# EAGLE schematic SARA_U201 (EAGLE 9.3.0)
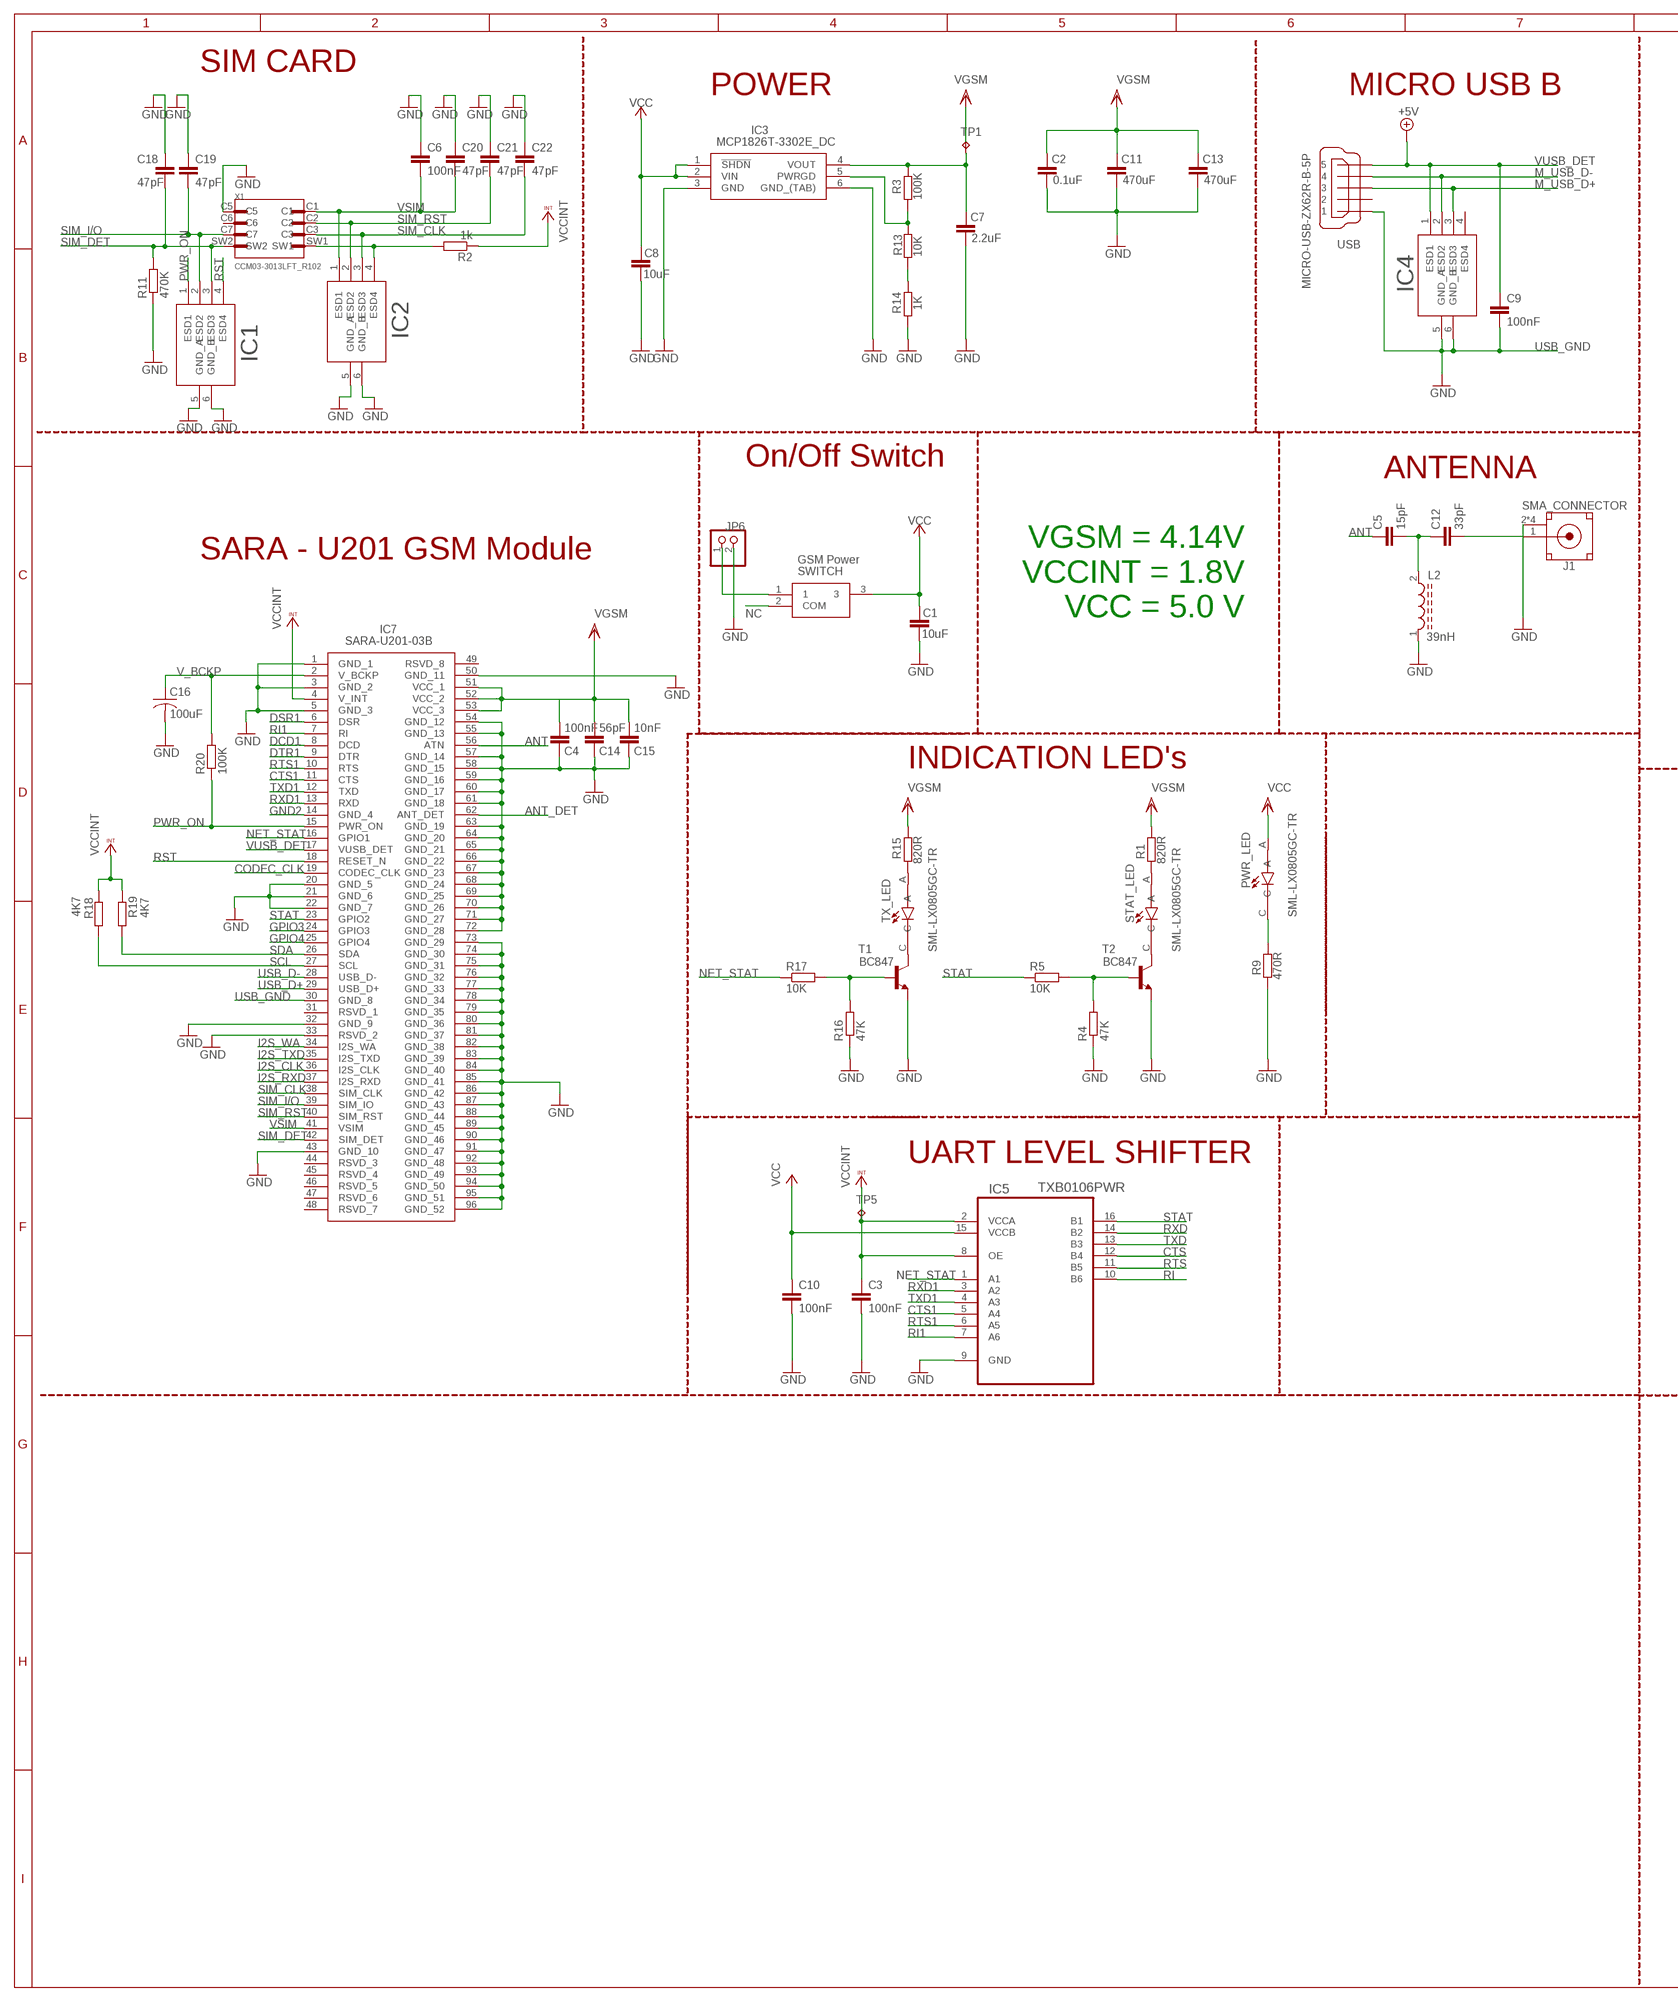
[diagram p0: schematic, sheet 1, part 1 of 2]
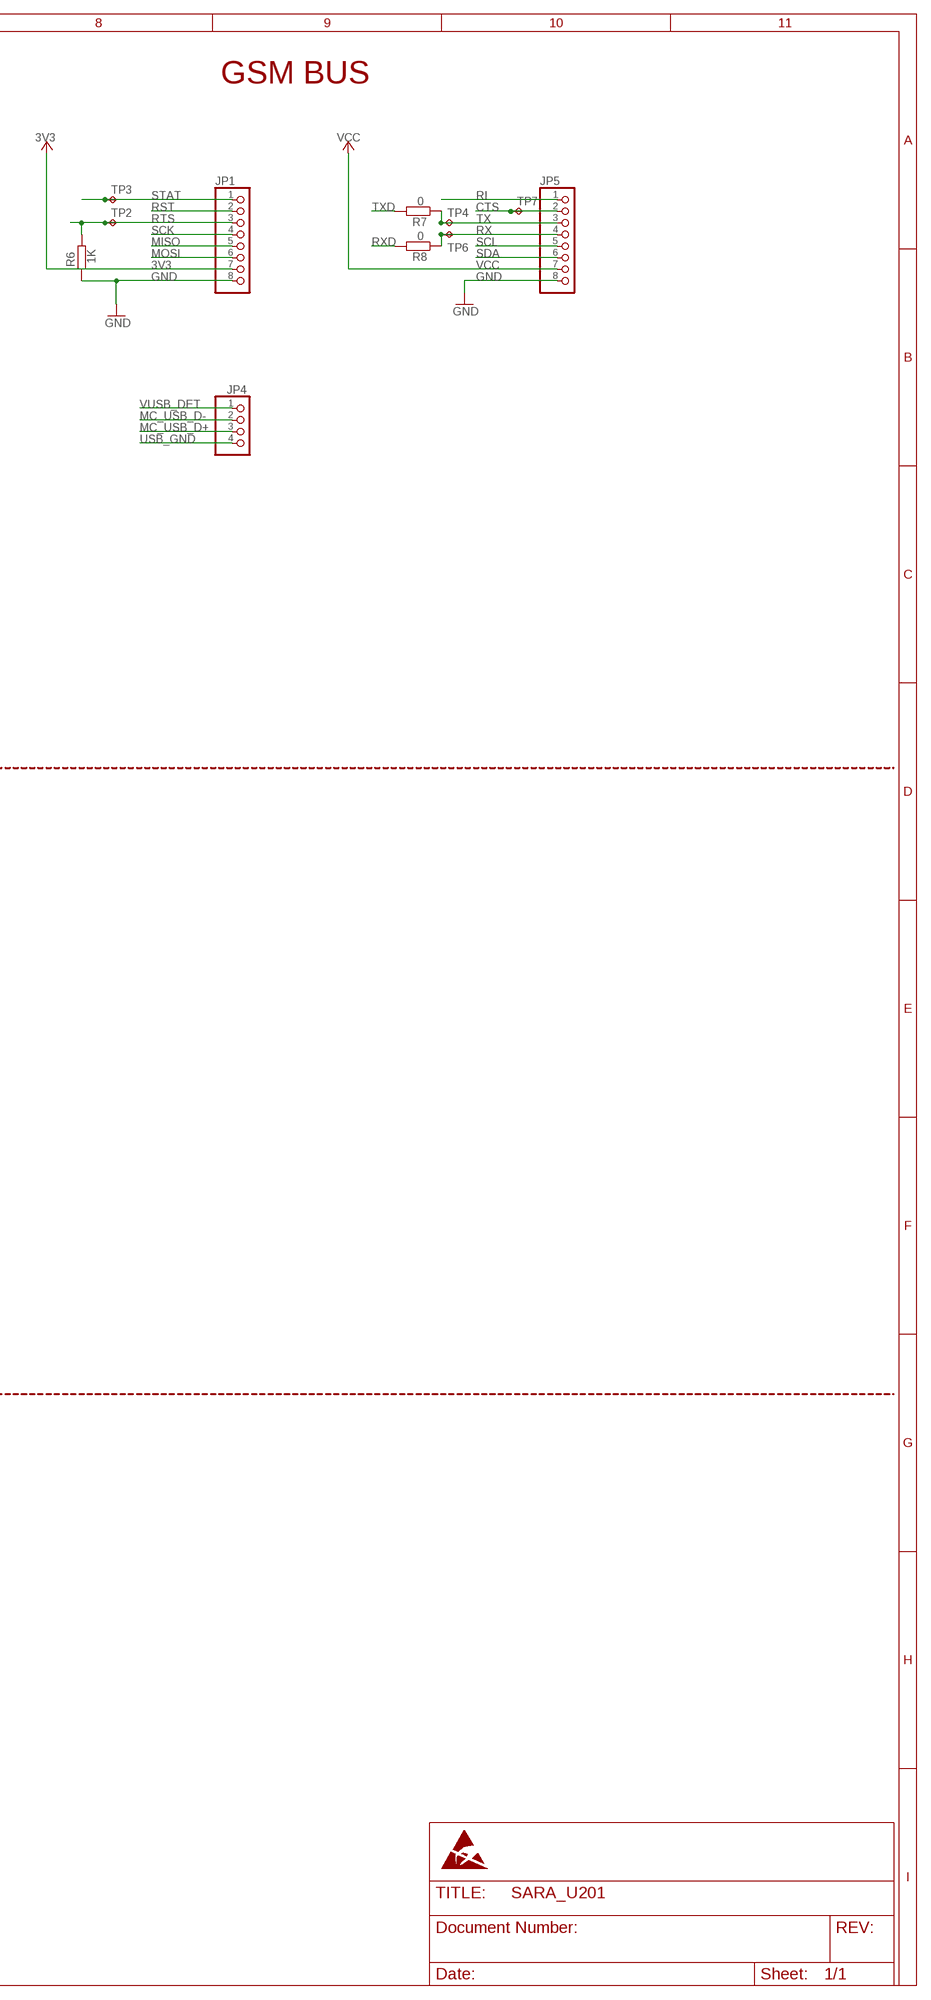
[diagram p1: schematic, sheet 1, part 2 of 2]

## Parts
C1  10uF  C-EUC0805  [C0805]
C2  0.1uF  C-EUC0805  [C0805]
C3  100nF  C-EUC0805  [C0805]
C4  100nF  C-EUC0805  [C0805]
C5  15pF  C-EUC0805  [C0805]
C6  100nF  C-EUC0805  [C0805]
C7  2.2uF  C-EUC0805  [C0805]
C8  10uF  C-EUC0805  [C0805]
C9  100nF  C-EUC0805  [C0805]
C10  100nF  C-EUC0805  [C0805]
C11  470uF  C-EUC0805  [C0805]
C12  33pF  C-EUC0805  [C0805]
C13  470uF  C-EUC0805  [C0805]
C14  56pF  C-EUC0805  [C0805]
C15  10nF  C-EUC0805  [C0805]
C16  100uF  C-USC0805  [C0805]
C18  47pF  C-EUC0805  [C0805]
C19  47pF  C-EUC0805  [C0805]
C20  47pF  C-EUC0805  [C0805]
C21  47pF  C-EUC0805  [C0805]
C22  47pF  C-EUC0805  [C0805]
IC1  SOT95P275X110-6N  [SOT95P275X110-6N]
IC2  SOT95P275X110-6N  [SOT95P275X110-6N]
IC3  MCP1826T-3302E_DC  [SOT127P706X180-6N]
IC4  SOT95P275X110-6N  [SOT95P275X110-6N]
IC5  TXB0106PWR  [SOP65P640X120-16N]
IC7  SARA-U201-03B  [SARA-U201-03B]
J1  SMA_CONNECTOR  [LPRS_SMA_CONNECTOR]
JP1  PINHD-1X8BIG  [1X08-BIG]
JP4  PINHD-1X4  [1X04]
JP5  PINHD-1X8BIG  [1X08-BIG]
JP6  PINHD-1X2  [1X02]
L2  39nH  SRR1260-470MLQW18AN39NJ8ZD  [FB_BLM18PG121SN1D]
PWR_LED  SML-LX0805GC-TR  [LEDC2012X120N]
R1  820R  R-EU_R0805  [R0805]
R2  1k  R-EU_R0805  [R0805]
R3  100K  R-EU_R0805  [R0805]
R4  47K  R-EU_R0805  [R0805]
R5  10K  R-EU_R0805  [R0805]
R6  1K  R-EU_R0805  [R0805]
R7  0  R-EU_R0805  [R0805]
R8  0  R-EU_R0805  [R0805]
R9  470R  R-EU_R0805  [R0805]
R11  470K  R-EU_R0805  [R0805]
R13  10K  R-EU_R0805  [R0805]
R14  1K  R-EU_R0805  [R0805]
R15  820R  R-EU_R0805  [R0805]
R16  47K  R-EU_R0805  [R0805]
R17  10K  R-EU_R0805  [R0805]
R18  4K7  R-EU_R0805  [R0805]
R19  4K7  R-EU_R0805  [R0805]
R20  100K  R-EU_R0805  [R0805]
STAT_LED  SML-LX0805GC-TR  [LEDC2012X120N]
SWITCH  GSM Power  EG1218  [3PIN_SLIDE_SWITCH]
T1  BC847  [SOT23]
T2  BC847  [SOT23]
TP1  TPB1,27  [B1,27]
TP2  TPB1,27  [B1,27]
TP3  TPB1,27  [B1,27]
TP4  TPB1,27  [B1,27]
TP5  TPB1,27  [B1,27]
TP6  TPB1,27  [B1,27]
TP7  TPB1,27  [B1,27]
TX_LED  SML-LX0805GC-TR  [LEDC2012X120N]
USB  MICRO-USB-ZX62R-B-5P  [ZX62R-B-5P]
X1  CCM03-3013LFT_R102  [C&K_CCM03-3013LFTR102]

## Nets
3V3: JP1.7 ; supply symbol labelled V+
ANT: C5.1 IC7.56(ATN)
ANT_DET: IC7.62(ANT_DET)
CODEC_CLK: IC7.19(CODEC_CLK)
CTS: IC5.12(B4) JP5.2 TP7.TP
CTS1: IC5.5(A4) IC7.11(CTS)
DCD1: IC7.8(DCD)
DSR1: IC7.6(DSR)
DTR1: IC7.9(DTR)
GND: C1.2 C2.2 C3.2 C4.1 C6.1 C7.2 C8.2 C10.2 C11.2 C13.2 C14.1 C15.1 C16.2 C18.1 C19.1 C20.1 C21.1 C22.1 IC1.5(GND_A) IC1.6(GND_B) IC2.5(GND_A) IC2.6(GND_B) IC3.3(GND) IC3.6(GND_(TAB)) IC5.9(GND) IC7.1(GND_1) IC7.3(GND_2) IC7.5(GND_3) IC7.20(GND_5) IC7.21(GND_6) IC7.22(GND_7) IC7.32(GND_9) IC7.33(RSVD_2) IC7.43(GND_10) IC7.50(GND_11) IC7.54(GND_12) IC7.55(GND_13) IC7.57(GND_14) IC7.58(GND_15) IC7.59(GND_16) IC7.60(GND_17) IC7.61(GND_18) IC7.63(GND_19) IC7.64(GND_20) IC7.65(GND_21) IC7.66(GND_22) IC7.67(GND_23) IC7.68(GND_24) IC7.69(GND_25) IC7.70(GND_26) IC7.71(GND_27) IC7.72(GND_28) IC7.73(GND_29) IC7.74(GND_30) IC7.75(GND_31) IC7.76(GND_32) IC7.77(GND_33) IC7.78(GND_34) IC7.79(GND_35) IC7.80(GND_36) IC7.81(GND_37) IC7.82(GND_38) IC7.83(GND_39) IC7.84(GND_40) IC7.85(GND_41) IC7.86(GND_42) IC7.87(GND_43) IC7.88(GND_44) IC7.89(GND_45) IC7.90(GND_46) IC7.91(GND_47) IC7.92(GND_48) IC7.93(GND_49) IC7.94(GND_50) IC7.95(GND_51) IC7.96(GND_52) J1.2(GND) J1.3(GND) J1.4(GND) J1.5(GND) JP1.8 JP5.8 JP6.2 L2.1 R4.1 R6.1 R9.1 R11.1 R14.1 R16.1 T1.2(E) T2.2(E) X1.C5
GND2: IC7.14(GND_4)
GPIO3: IC7.24(GPIO3)
GPIO4: IC7.25(GPIO4)
I2S_CLK: IC7.36(I2S_CLK)
I2S_RXD: IC7.37(I2S_RXD)
I2S_TXD: IC7.35(I2S_TXD)
I2S_WA: IC7.34(I2S_WA)
M_USB_D+: IC4.3(ESD3) USB.3
M_USB_D-: IC4.2(ESD2) USB.4
MC_USB_D+: JP4.3
MC_USB_D-: JP4.2
MISO: JP1.5
MOSI: JP1.6
N$1: STAT_LED.C T2.3(C)
N$2: IC3.5(PWRGD) R3.1 R13.2
N$3: R13.1 R14.2
N$4: JP6.1 SWITCH.1
N$5: IC2.4(ESD4) R2.2 X1.SW1
N$6: C12.2 J1.1(SIG)
N$7: C5.2 C12.1 L2.2
N$8: T1.3(C) TX_LED.C
N$9: R15.1 TX_LED.A
N$10: R1.1 STAT_LED.A
N$11: PWR_LED.C R9.2
NC: SWITCH.2(COM)
NET_STAT: IC5.1(A1) IC7.16(GPIO1) R4.2 R5.2 R16.2 R17.1 R17.2 T1.1(B) T2.1(B)
PWR_ON: IC1.1(ESD1) IC7.15(PWR_ON) R20.1
RI: IC5.10(B6) JP5.1
RI1: IC5.7(A6) IC7.7(RI)
RST: IC1.4(ESD4) IC7.18(RESET_N) JP1.2
RTS: IC5.11(B5) JP1.3 R6.2 TP2.TP
RTS1: IC5.6(A5) IC7.10(RTS)
RX: JP5.4 R8.1 TP6.TP
RXD: IC5.14(B2) R8.2
RXD1: IC5.3(A2) IC7.13(RXD)
SCK: JP1.4
SCL: IC7.27(SCL) JP5.5 R18.2
SDA: IC7.26(SDA) JP5.6 R19.2
SIM_CLK: C22.2 IC2.3(ESD3) IC7.38(SIM_CLK) X1.C3
SIM_DET: C18.2 IC1.3(ESD3) IC7.42(SIM_DET) R11.2 X1.SW2
SIM_I/O: C19.2 IC1.2(ESD2) IC7.39(SIM_IO) X1.C7
SIM_RST: C21.2 IC2.2(ESD2) IC7.40(SIM_RST) X1.C2
STAT: IC5.16(B1) IC7.23(GPIO2) JP1.1 R5.1 TP3.TP
TX: JP5.3 R7.1 TP4.TP
TXD: IC5.13(B3) R7.2
TXD1: IC5.4(A3) IC7.12(TXD)
USB_D+: IC7.29(USB_D+)
USB_D-: IC7.28(USB_D-)
USB_GND: C9.2 IC4.5(GND_A) IC4.6(GND_B) IC7.30(GND_8) JP4.4 USB.1 ; supply symbol labelled GND
V_BCKP: C16.1 IC7.2(V_BCKP) R20.2
VCC: C1.1 C8.1 C10.1 IC3.1(!SHDN) IC3.2(VIN) IC5.15(VCCB) JP5.7 PWR_LED.A SWITCH.3 ; supply symbol labelled V+, VDD
VCCINT: C3.1 IC5.2(VCCA) IC5.8(OE) IC7.4(V_INT) R2.1 R18.1 R19.1 TP5.TP
VDD: C2.1 C11.1 C13.1
VGSM: C4.2 C7.1 C14.2 C15.2 IC3.4(VOUT) IC7.51(VCC_1) IC7.52(VCC_2) IC7.53(VCC_3) R1.2 R3.2 R15.2 TP1.TP ; supply symbol labelled VDD
VSIM: C6.2 C20.2 IC2.1(ESD1) IC7.41(VSIM) X1.C1
VUSB_DET: C9.1 IC4.1(ESD1) IC7.17(VUSB_DET) JP4.1 USB.5 ; supply symbol labelled +5V
Unconnected: IC4.4(ESD4) IC7.31(RSVD_1) IC7.44(RSVD_3) IC7.45(RSVD_4) IC7.46(RSVD_5) IC7.47(RSVD_6) IC7.48(RSVD_7) IC7.49(RSVD_8) USB.2 X1.C6

## Notes on the sheet
- SIM CARD
- GSM BUS
- POWER | MICRO USB B
- IC4
- IC2
- IC1
- On/Off Switch
- ANTENNA
- VGSM = 4.14V
  VCCINT = 1.8V
  VCC = 5.0 V
- SARA - U201 GSM Module
- INDICATION LED's
- UART LEVEL SHIFTER

## Library data of the parts
C1-C15 C18-C22 = rcl:C-EU: CAPACITOR, European symbol; SPICEPREFIX: C
C16 = rcl:C-US: CAPACITOR, American symbol; SPICEPREFIX: C
IC1 IC2 IC4 = SOT95P275X110-6N:SOT95P275X110-6N
IC3 = MCP1826T-3302E_DC:MCP1826T-3302E_DC: LDO Regulator 1A 3.3V PG SOT223-5 MCP1826T-3302E/DC, Low Dropout Voltage Regulator, 1A, 3.3 V +/-2%, 2.3 6 Vin, 6-Pin SOT-223 Source: Datasheet <http://ww1.microchip.com/downloads/en/DeviceDoc/22057B.pdf>; ALLIED_NUMBER: 70048318; ALLIED_PRICE-STOCK: http://www.alliedelec.com/microchip-technology-inc-mcp1826t-3302e-dc/70048318/; DESCRIPTION: LDO Regulator 1A 3.3V PG SOT223-5 MCP1826T-3302E/DC, Low Dropout Voltage Regulator, 1A, 3.3 V +/-2%, 2.3 6 Vin, 6-Pin SOT-223; HEIGHT: 1.8mm; MANUFACTURER_NAME: Microchip; MANUFACTURER_PART_NUMBER: MCP1826T-3302E/DC; MOUSER_PART_NUMBER: 579-MCP1826T-3302EDC; MOUSER_PRICE-STOCK: https://www.mouser.com/Search/Refine.aspx?Keyword=579-MCP1826T-3302EDC; RS_PART_NUMBER: 6695190P; RS_PRICE-STOCK: http://uk.rs-online.com/web/p/products/6695190P
IC5 = TXB0106PWR:TXB0106PWR: VOLTAGE-LEVEL TRANSLATOR; DESCRIPTION: 6-Bit Bidirectional Voltage-Level Translator with Auto Direction Sensing and +/-15-kV ESD Protect 16-TSSOP -40 to 85; DIGI-KEY_PART_NUMBER: 296-23759-1-ND; DIGI-KEY_PURCHASE_URL: https://www.digikey.in/product-detail/en/texas-instruments/TXB0106PWR/296-23759-1-ND/1951146?utm_source=snapeda&utm_medium=aggregator&utm_campaign=symbol; MF: Texas Instruments; MP: TXB0106PWR; PACKAGE: TSSOP-16 Texas Instruments
IC7 = SARA-U201-03B:SARA-U201-03B: RF TXRX MODULE CELLULAR Source: Datasheet <https://www.u-blox.com/sites/default/files/SARA-U2_DataSheet_(UBX-13005287).pdf>; DESCRIPTION: RF TXRX MODULE CELLULAR; HEIGHT: mm; MANUFACTURER_NAME: U-Blox; MANUFACTURER_PART_NUMBER: SARA-U201-03B
J1 = SMA_CONNECTOR:SMA_CONNECTOR: CONNECTOR, SMA, ANTENNA; SVHC: No SVHC (19-Dec-2012); For Use With: Antenna; Kit Contents: SMA Connecto; AVAILABILITY: Unavailable; DESCRIPTION: CONNECTOR, SMA, ANTENNA; SVHC: No SVHC _19-Dec-2012_; For Use With: Antenna; Kit Contents: SMA Connector; MF: Assmann WSW; MP: SMA CONNECTOR; PACKAGE: None; PRICE: None
JP1 JP5 = adafruit:PINHD-1X8: PIN HEADER
JP4 = pinhead:PINHD-1X4: PIN HEADER
JP6 = pinhead:PINHD-1X2: PIN HEADER
L2 = 490-15685-1-ND:SRR1260-470M: Inductor Power Shielded Wirewound 33uH 20% 100KHz 27Q-Factor Ferrite 3A 60mOhm DCR T/R
PWR_LED STAT_LED TX_LED = SML-LX0805GC-TR:SML-LX0805GC-TR: 1.25X2mm SMD PCB LED,GREEN, WTR,TP&RL; DESCRIPTION: Green 2 x 1.25 mm 0805 140° Water Clear 10 mcd 2.2 V LED SMT; DIGI-KEY_PART_NUMBER: 67-2188-1-ND; DIGI-KEY_PURCHASE_URL: https://www.digikey.in/product-detail/en/lumex-opto-components-inc/SML-LX0805GC-TR/67-2188-1-ND/4172828?utm_source=snapeda&utm_medium=aggregator&utm_campaign=symbol; MF: Lumex Opto/Components; MP: SML-LX0805GC-TR; PACKAGE: 0805 Lumex
R1-R9 R11 R13-R20 = rcl:R-EU_: RESISTOR, European symbol; SPICEPREFIX: R
SWITCH = EG1218:EG1218: Slide Switch Source: Datasheet <http://spec_sheets.e-switch.com/specs/P040040.pdf>; DESCRIPTION: Slide Switch; HEIGHT: mm; MANUFACTURER_NAME: E-Switch; MANUFACTURER_PART_NUMBER: EG1218; MOUSER_PART_NUMBER: 612-EG1218; MOUSER_PRICE-STOCK: https://www.mouser.com/Search/Refine.aspx?Keyword=612-EG1218
T1 T2 = transistor:BC847: NPN TRANSISTOR
TP1-TP7 = testpad:TP: Test pad
USB = con-hirose:MICRO-USB-: Hirose Micro USB Connector ZX62R-B-5P: Micro B, reverse (top mount) shell SMT Supplier: DigiKey H11574CT-ND Source: http://www.hirose.co.jp/cataloge_hp/e24200011.pdf
X1 = CCM03-3013LFT_R102:CCM03-3013LFT_R102: Conn SIM/SAM M 6 POS 2.54mm Solder RA SMD 1A T/R; DESCRIPTION: Conn SIM/SAM M 6 POS 2.54mm Solder RA SMD 1A T/R; DIGI-KEY_PART_NUMBER: 401-1722-1-ND; DIGI-KEY_PURCHASE_URL: https://www.digikey.in/product-detail/en/c-k/CCM03-3013LFT-R102/401-1722-1-ND/936357?utm_source=snapeda&utm_medium=aggregator&utm_campaign=symbol; MF: C&K; MP: CCM03-3013LFT R102; PACKAGE: None

## Net classes
0 default: width 0.19 mm, drill 0.19 mm